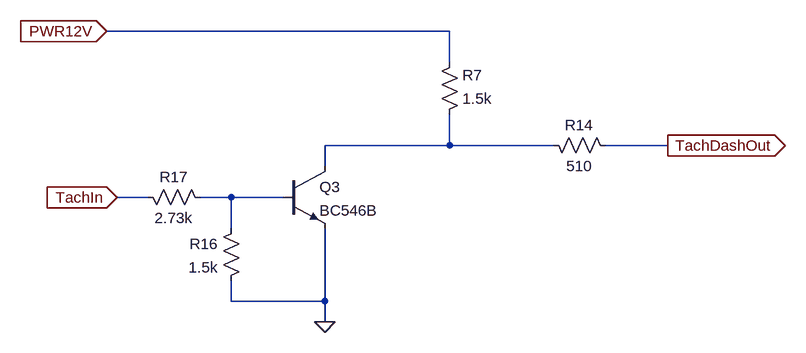
[diagram p0: schematic dme_analog_tach.asc]
dme_analog_tach.asc, the LTspice schematic file:
Version 4
SHEET 1 4356 3824
WIRE 528 1680 0 1680
WIRE 528 1728 528 1680
WIRE 528 1856 528 1808
WIRE 528 1856 336 1856
WIRE 688 1856 528 1856
WIRE 864 1856 768 1856
WIRE 336 1888 336 1856
WIRE 64 1936 16 1936
WIRE 192 1936 144 1936
WIRE 272 1936 192 1936
WIRE 192 1984 192 1936
WIRE 192 2096 192 2064
WIRE 336 2096 336 1984
WIRE 336 2096 192 2096
WIRE 336 2128 336 2096
FLAG 336 2128 0
FLAG 16 1936 TachIn
IOPIN 16 1936 In
FLAG 864 1856 TachDashOut
IOPIN 864 1856 Out
FLAG 0 1680 PWR12V
IOPIN 0 1680 In
SYMBOL Res 512 1824 M180
WINDOW 0 36 76 Left 2
WINDOW 3 36 40 Left 2
SYMATTR InstName R7
SYMATTR Value 1.5k
SYMBOL npn 272 1888 R0
SYMATTR InstName Q3
SYMATTR Value BC546B
SYMBOL Res 208 1968 M0
SYMATTR InstName R16
SYMATTR Value 1.5k
SYMBOL Res 48 1920 M90
WINDOW 0 0 56 VBottom 2
WINDOW 3 32 56 VTop 2
SYMATTR InstName R17
SYMATTR Value 2.73k
SYMBOL Res 672 1840 M90
WINDOW 0 0 56 VBottom 2
WINDOW 3 32 56 VTop 2
SYMATTR InstName R14
SYMATTR Value 510

The netlist it stands for:
* dme_analog_tach.asc
R7 N001 PWR12V 1.5k
Q3 N001 N002 0 0 BC546B
R16 N002 0 1.5k
R17 TachIn N002 2.73k
R14 N001 TachDashOut 510
.model NPN NPN
.model PNP PNP
.lib standard.bjt
.backanno
.end